# Altium schematic sheet MCU.SchDoc
size A3; SheetNumber: 3; SheetTotal: 13
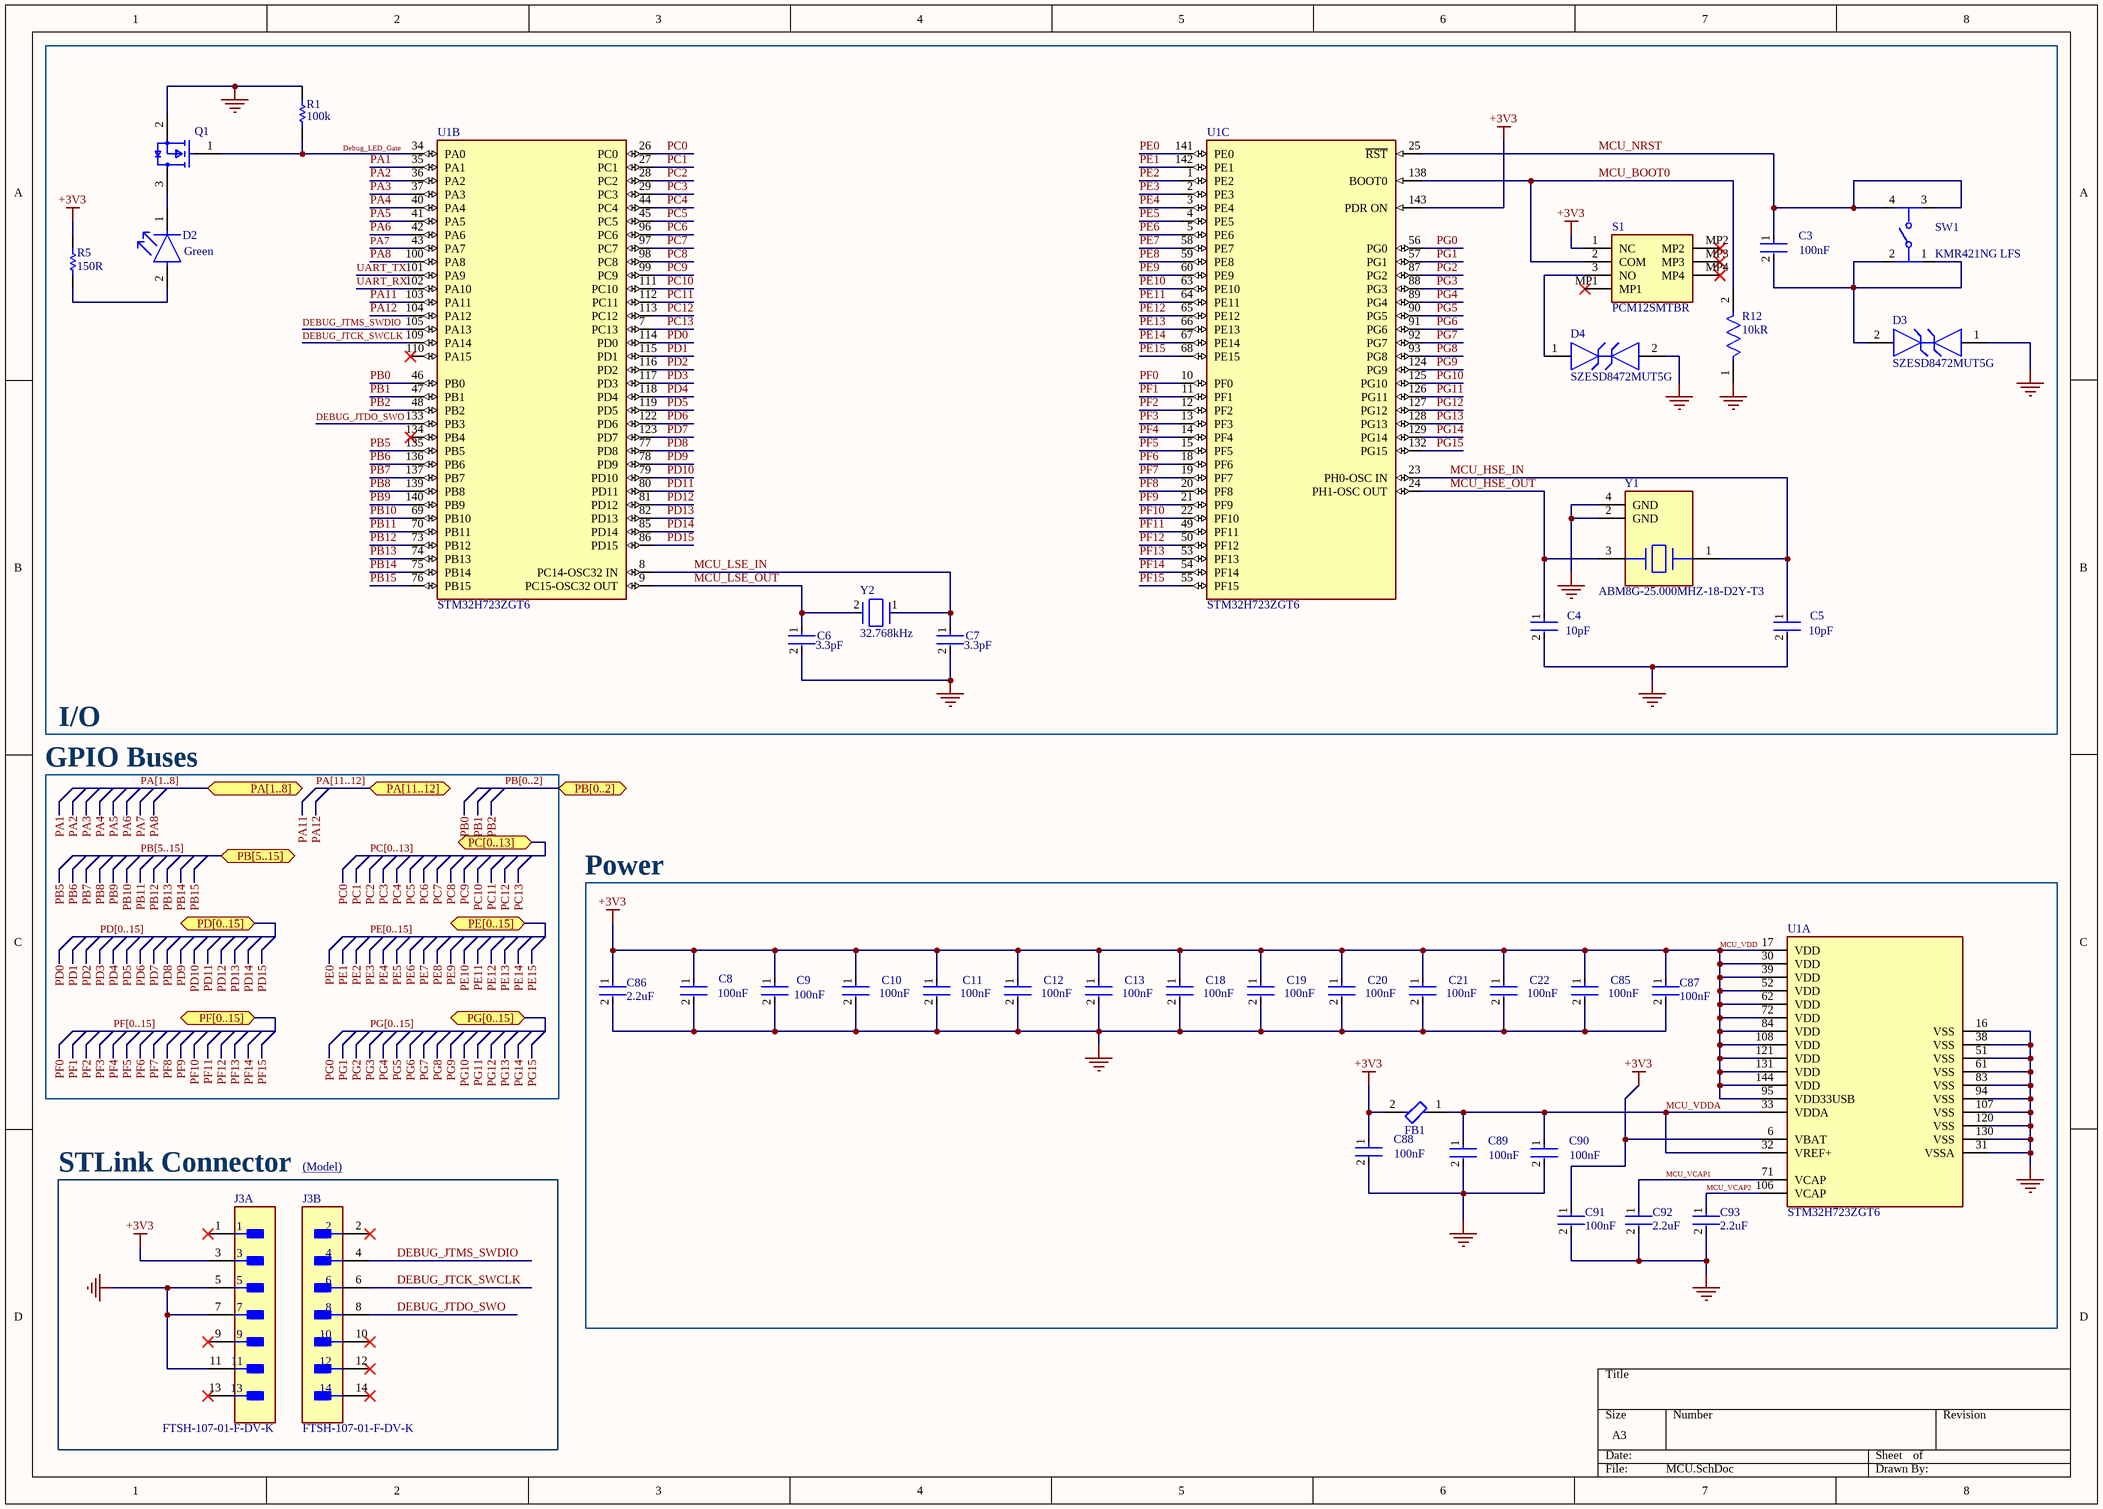
[diagram p0: MCU.SchDoc]

## Parts
C3  Capacitance: 100nF  [FP-GCM155-0_05-IPC_A]  (hidden comment: GCM155R71H104ME02J)
C4  Capacitance: 10pF  [FP-GCM155-0_05-IPC_B]  (hidden comment: GCM1555G1H100GA16D)
C5  Capacitance: 10pF  [FP-GCM155-0_05-IPC_B]  (hidden comment: GCM1555G1H100GA16D)
C6  Capacitance: 3.3pF  [FP-GCM155-0_05-IPC_C]  (hidden comment: GCM1555C1H3R3CA16J)
C7  Capacitance: 3.3pF  [FP-GCM155-0_05-IPC_C]  (hidden comment: GCM1555C1H3R3CA16J)
C8  Capacitance: 100nF  [FP-GCM155-0_05-IPC_A]  (hidden comment: GCM155R71H104ME02J)
C9  Capacitance: 100nF  [FP-GCM155-0_05-IPC_A]  (hidden comment: GCM155R71H104ME02J)
C10  Capacitance: 100nF  [FP-GCM155-0_05-IPC_A]  (hidden comment: GCM155R71H104ME02J)
C11  Capacitance: 100nF  [FP-GCM155-0_05-IPC_A]  (hidden comment: GCM155R71H104ME02J)
C12  Capacitance: 100nF  [FP-GCM155-0_05-IPC_A]  (hidden comment: GCM155R71H104ME02J)
C13  Capacitance: 100nF  [FP-GCM155-0_05-IPC_A]  (hidden comment: GCM155R71H104ME02J)
C18  Capacitance: 100nF  [FP-GCM155-0_05-IPC_A]  (hidden comment: GCM155R71H104ME02J)
C19  Capacitance: 100nF  [FP-GCM155-0_05-IPC_A]  (hidden comment: GCM155R71H104ME02J)
C20  Capacitance: 100nF  [FP-GCM155-0_05-IPC_A]  (hidden comment: GCM155R71H104ME02J)
C21  Capacitance: 100nF  [FP-GCM155-0_05-IPC_A]  (hidden comment: GCM155R71H104ME02J)
C22  Capacitance: 100nF  [FP-GCM155-0_05-IPC_A]  (hidden comment: GCM155R71H104ME02J)
C85  Capacitance: 100nF  [FP-GCM155-0_05-IPC_A]  (hidden comment: GCM155R71H104ME02J)
C86  Capacitance: 2.2uF  [FP-GCH188-0_1-e0_2_0_5-MFG]  (hidden comment: GCM188C71A225KE02D)
C87  Capacitance: 100nF  [FP-GCM155-0_05-IPC_A]  (hidden comment: GCM155R71H104ME02J)
C88  Capacitance: 100nF  [FP-GCM155-0_05-IPC_A]  (hidden comment: GCM155R71H104ME02J)
C89  Capacitance: 100nF  [FP-GCM155-0_05-IPC_A]  (hidden comment: GCM155R71H104ME02J)
C90  Capacitance: 100nF  [FP-GCM155-0_05-IPC_A]  (hidden comment: GCM155R71H104ME02J)
C91  Capacitance: 100nF  [FP-GCM155-0_05-IPC_A]  (hidden comment: GCM155R71H104ME02J)
C92  Capacitance: 2.2uF  [FP-GCH188-0_1-e0_2_0_5-MFG]  (hidden comment: GCM188C71A225KE02D)
C93  Capacitance: 2.2uF  [FP-GCH188-0_1-e0_2_0_5-MFG]  (hidden comment: GCM188C71A225KE02D)
D2  Colour: Green  [FP-SML-P1-MFG]  (hidden comment: SML-P13PTT86R)
D3  SZESD8472MUT5G  [FP-152AF-MFG]
D4  SZESD8472MUT5G  [FP-152AF-MFG]
FB1  BLM15BX102SZ1D  [FP-BLM15-0_05-MFG]  (value not drawn)
J3  FTSH-107-01-F-DV-K  [FP-FTSH-107-01-F-DV-K-MFG]  (parts A,B of 2)
Q1  2N7002H6327XTSA2  [FP-PG-SOT23-3-MFG]  (value not drawn)
R1  Resistance: 100k  [RESC1005X40X25NL05T10]  (hidden comment: RC0402FR-07100KL)
R5  Resistance: 150R  [RESC1005X40X25LL05T10]  (hidden comment: RC0402JR-13150RL)
R12  Resistance: 10kR  [FP-RC0402-0_4-IPC_A]  (hidden comment: RC0402FR-1310KL)
S1  PCM12SMTBR  [PCM12SMTBR]
SW1  KMR421NG LFS  [FP-KMR421NG_LFS-MFG]
U1  STM32H723ZGT6  [FP-LQFP144-1A-IPC_A]  (parts A,B,C of 3)
Y1  ABM8G-25.000MHZ-18-D2Y-T3  [FP-ABM8G-MFG]
Y2  Frequency: 32.768kHz  [FP-ECX-34Q-MFG]  (hidden comment: ECS-.327-6-34QCN-TR)

## Blocks framed on the sheet
I/O: C3-C7 D2-D4 Q1 R1 R5 R12 S1 SW1 U1 Y1 Y2
Power: C8-C13 C18-C22 C85-C93 FB1 U1
STLink Connector: J3

## Ports
PA[1..8] (bidir, see MCU_Connections[7A]), PA[11..12] (bidir, see MCU_Connections[7A]), PB[0..2] (bidir, see MCU_Connections[7A]), PB[5..15] (bidir, see MCU_Connections[7A]), PC[0..13] (bidir, see MCU_Connections[7A]), PD[0..15] (bidir, see MCU_Connections[7A]), PE[0..15] (bidir, see MCU_Connections[7A]), PF[0..15] (bidir, see MCU_Connections[7A]), PG[0..15] (bidir, see MCU_Connections[7A])

## Nets
GND: C4.2 C5.2 C6.2 C7.2 C8.2 C9.2 C10.2 C11.2 C12.2 C13.2 C18.2 C19.2 C20.2 C21.2 C22.2 C85.2 C86.2 C87.2 C88.2 C89.2 C90.2 C91.2 C92.2 C93.2 D3.1 D4.2 J3.5 J3.7 J3.11 Q1.2(source) R1.2 R12.1 U1.16(VSS) U1.31(VSSA) U1.38(VSS) U1.51(VSS) U1.61(VSS) U1.83(VSS) U1.94(VSS) U1.107(VSS) U1.120(VSS) U1.130(VSS) Y1.2(GND) Y1.4(GND)
MCU_VDD: C8.1 C9.1 C10.1 C11.1 C12.1 C13.1 C18.1 C19.1 C20.1 C21.1 C22.1 C85.1 C86.1 C87.1 C88.1 C91.1 FB1.2 J3.3 R5.2 S1.1(NC) U1.6(VBAT) U1.17(VDD) U1.30(VDD) U1.39(VDD) U1.52(VDD) U1.62(VDD) U1.72(VDD) U1.84(VDD) U1.95(VDD33USB) U1.108(VDD) U1.121(VDD) U1.131(VDD) U1.143(PDR_ON) U1.144(VDD)  [also labelled +3V3]
DEBUG_JTCK_SWCLK: J3.6 U1.109(PA14)
DEBUG_JTDO_SWO: J3.8 U1.133(PB3)
DEBUG_JTMS_SWDIO: J3.4 U1.105(PA13)
Debug_LED_Gate: Q1.1(gate) R1.1 U1.34(PA0)
MCU_BOOT0: R12.2 S1.2(COM) U1.138(BOOT0)
MCU_HSE_IN: C5.1 U1.23(PH0-OSC_IN) Y1.1
MCU_HSE_OUT: C4.1 U1.24(PH1-OSC_OUT) Y1.3
MCU_LSE_IN: C7.1 U1.8(PC14-OSC32_IN) Y2.1(In/Out)
MCU_LSE_OUT: C6.1 U1.9(PC15-OSC32_OUT) Y2.2(Out/In)
MCU_NRST: C3.1 SW1.3 SW1.4 U1.25(~{RST})
MCU_VCAP1: C92.1 U1.71(VCAP)
MCU_VCAP2: C93.1 U1.106(VCAP)
MCU_VDDA: C89.1 C90.1 FB1.1 U1.32(VREF+) U1.33(VDDA)
PA1: U1.35(PA1)
PA2: U1.36(PA2)
PA3: U1.37(PA3)
PA4: U1.40(PA4)
PA5: U1.41(PA5)
PA6: U1.42(PA6)
PA7: U1.43(PA7)
PA8: U1.100(PA8)
PA11: U1.103(PA11)
PA12: U1.104(PA12)
PB0: U1.46(PB0)
PB1: U1.47(PB1)
PB2: U1.48(PB2)
PB5: U1.135(PB5)
PB6: U1.136(PB6)
PB7: U1.137(PB7)
PB8: U1.139(PB8)
PB9: U1.140(PB9)
PB10: U1.69(PB10)
PB11: U1.70(PB11)
PB12: U1.73(PB12)
PB13: U1.74(PB13)
PB14: U1.75(PB14)
PB15: U1.76(PB15)
PC0: U1.26(PC0)
PC1: U1.27(PC1)
PC2: U1.28(PC2)
PC3: U1.29(PC3)
PC4: U1.44(PC4)
PC5: U1.45(PC5)
PC6: U1.96(PC6)
PC7: U1.97(PC7)
PC8: U1.98(PC8)
PC9: U1.99(PC9)
PC10: U1.111(PC10)
PC11: U1.112(PC11)
PC12: U1.113(PC12)
PC13: U1.7(PC13)
PD0: U1.114(PD0)
PD1: U1.115(PD1)
PD2: U1.116(PD2)
PD3: U1.117(PD3)
PD4: U1.118(PD4)
PD5: U1.119(PD5)
PD6: U1.122(PD6)
PD7: U1.123(PD7)
PD8: U1.77(PD8)
PD9: U1.78(PD9)
PD10: U1.79(PD10)
PD11: U1.80(PD11)
PD12: U1.81(PD12)
PD13: U1.82(PD13)
PD14: U1.85(PD14)
PD15: U1.86(PD15)
PE0: U1.141(PE0)
PE1: U1.142(PE1)
PE2: U1.1(PE2)
PE3: U1.2(PE3)
PE4: U1.3(PE4)
PE5: U1.4(PE5)
PE6: U1.5(PE6)
PE7: U1.58(PE7)
PE8: U1.59(PE8)
PE9: U1.60(PE9)
PE10: U1.63(PE10)
PE11: U1.64(PE11)
PE12: U1.65(PE12)
PE13: U1.66(PE13)
PE14: U1.67(PE14)
PE15: U1.68(PE15)
PF0: U1.10(PF0)
PF1: U1.11(PF1)
PF2: U1.12(PF2)
PF3: U1.13(PF3)
PF4: U1.14(PF4)
PF5: U1.15(PF5)
PF6: U1.18(PF6)
PF7: U1.19(PF7)
PF8: U1.20(PF8)
PF9: U1.21(PF9)
PF10: U1.22(PF10)
PF11: U1.49(PF11)
PF12: U1.50(PF12)
PF13: U1.53(PF13)
PF14: U1.54(PF14)
PF15: U1.55(PF15)
PG0: U1.56(PG0)
PG1: U1.57(PG1)
PG2: U1.87(PG2)
PG3: U1.88(PG3)
PG4: U1.89(PG4)
PG5: U1.90(PG5)
PG6: U1.91(PG6)
PG7: U1.92(PG7)
PG8: U1.93(PG8)
PG9: U1.124(PG9)
PG10: U1.125(PG10)
PG11: U1.126(PG11)
PG12: U1.127(PG12)
PG13: U1.128(PG13)
PG14: U1.129(PG14)
PG15: U1.132(PG15)
UART_RX: U1.102(PA10)
UART_TX: U1.101(PA9)
NetC3_2: C3.2 D3.2 SW1.1 SW1.2
NetD2_1: D2.1(C) Q1.3(drain)
NetD2_2: D2.2(A) R5.1
NetD4_1: D4.1 S1.3(NO)

Not connected (* = marked no-connect by the designer): J3 1* 2* 9* 10* 12* 13* 14*; S1 MP1* MP2* MP3* MP4*; U1 110(PA15)* 134(PB4)*

## Buses and harness runs
bus PA[1..8] = port PA[1..8]
bus PA[11..12] = port PA[11..12]
bus PB[0..2] = port PB[0..2]
bus PB[5..15] = port PB[5..15]
bus PC[0..13] = port PC[0..13]
bus PD[0..15] = port PD[0..15]
bus PE[0..15] = port PE[0..15]
bus PF[0..15] = port PF[0..15]
bus PG[0..15] = port PG[0..15]

## Notes on the sheet
- GPIO Buses
- (Model) <https://au.mouser.com/ProductDetail/STMicroelectronics/STLINK-V3MINIE?qs=MyNHzdoqoQKcLQe5Jawcgw%3D%3D>

## Library data of the parts
C3 C8-C13 C18-C22 C85 C87-C91 = CMP-06035-028957-1: Ceramic Capacitor for Automotive 100nF ±20% 50VDC X7R 0402 Paper T/R
C4 C5 = CMP-06035-053638-1: Ceramic Capacitor for Automotive 10pF ±2% 50VDC X8G 0402 Paper T/R
C6 C7 = CMP-06035-005325-1: Ceramic Capacitor for Automotive 3.3pF ±0.25pF 50VDC C0G 0402 Paper T/R; Voltage Rating (DC): 50V; Packaging: Tape and Reel; Max Operating Temperature: 125°C; Length: 0.039inch; Min Operating Temperature: -55°C; Ratings: AEC-Q200; Voltage Rating: 50V; Case Code (Metric): 1005; Width: 0.5mm; Case/Package: 0402; Height: 0.5mm; Weight: 0.000212oz; Mount: Surface Mount; Termination: SMD/SMT; Thickness: 0.022inch; Package Quantity: 50000; Dielectric: C0G; Case Code (Imperial): 0402
C86 C92 C93 = CMP-00260-57357036-1: GCM188C71A225KE02D Multilayer Ceramic Capacitor, 2.2 uF, 10 V, ± 10%, X7S, 0603 [1608 Metric]; NexarPartId: 57357036; RoHS: Non-Compliant; Lifecycle Status: Production
D2 = CMP-08952-000015-1: LED GREEN CLEAR 1006 SMD; Manufacturer: Rohm; Power Dissipation: 52mW; Forward Current: 20mA; Reverse Voltage: 5V; Led Orientation: Top View; Forward Voltage: 2.1V; Luminous Intensity: 10mcd; Wavelength: 560nm; Temperature: -40°C to +85°C; Digikey Description: LED GREEN CLEAR 1006 SMD; Manufacturer Part Number: SML-P13PTT86R; Lead Free: Yes; Height: 0.25mm; Package: SML-P1; RoHS: TRUE; Mouser Description: LED Uni-Color Green 2-Pin Chip 0402(1006Metric) T/R; Device Class L2: LEDs; ComponentLink2URL: https://d1d2qsbl8m0m72.cloudfront.net/en/products/databook/datasheet/opto/led/chip_mono/sml-p1-e.pdf; Device Class L1: Optoelectronics; ComponentLink2Description: Datasheet; Category: Diode; Temperature Range High: +85°C; Automotive: No; Temperature Range Low: -40°C; Octopart: https://octopart.com/sml-p13ptt86r-rohm-59370256; Device Class L3: unset
D3 D4 = CMP-07200-000010-1: TVS DIODE 5.3V 14V 2X3DFN; Number of Bidirectional Channels: 1; Element Configuration: Single; Capacitance: 0.3pF; Peak Pulse Current: 3A; Power Line Protection: No; Min Breakdown Voltage: 7V; Direction: Bidirectional; Case/Package: DFN; Lead Free: Lead Free; Reverse Standoff Voltage: 5.3V; Clamping Voltage: 14V; Resistor Type: Zener; Packaging: Tape and Reel; Mount: Surface Mount; Number of Pins: 2; Max Operating Temperature: 150°C; Min Operating Temperature: -55°C; Working Voltage: 5.3V; RoHS Compliant: Yes
FB1 = CMP-06046-001231-1: Chip Ferrite Bead, 0402, 1000Ω @ 100MHz, 0.65Ω, 25%, 300mA
J3 = CMP-02766-001448-1: CONN HEADER SMD 14POS 1.27MM; Gender: Male; Connector Type: Male Pin; Number of Contacts: 14; Row Spacing: 0.05inch; Min Operating Temperature: -55°C; Package Quantity: 1; Lead Free: Lead Free; RoHS Compliant: Yes; Contact Material: Bronze; Contact Plating: Gold; Number of Rows: 2; Housing Material: Polymer; Contact Type: Male Pin; Series: FTSH; Max Operating Temperature: 125°C; Orientation: Straight; Number of Positions: 14; Pitch: 1.27mm; Housing Color: Black; Color: Black; Radiation Hardening: No; Length: 8.89mm; Termination: Solder; Packaging: Rail/Tube; Depth: 5.84mm; Mount: Surface Mount; Contact Mating Length: 0.12inch
Q1 = CMP-32901-000180-1: MOSFET N-CH 60V 0.3A SOT23; Rise Time: 3.3ns; Input Capacitance: 20pF; Rds On Max: 3R; Gate to Source Voltage (Vgs): 20V; Continuous Drain Current (ID): 300mA; Max Power Dissipation: 500mW; Packaging: Tape and Reel; Mount: Surface Mount; Case/Package: SOT-23; Drain to Source Voltage (Vdss): 60V; Min Operating Temperature: -55°C; Halogen Free: Halogen Free; Max Dual Supply Voltage: 60V; Number of Pins: 3; Lead Free: Lead Free; Max Operating Temperature: 150°C
R1 = CMP-2002-07343-1: Manufacturer: Yageo / Phycomp; Part Number: RC0402FR-07100KL
R5 = CMP-2002-08067-1: Manufacturer: Yageo; Part Number: RC0402JR-13150RL
R12 = CMP-2002-07854-2: RESISTOR 0402 10K 1%; Power Rating: 62.5mW; Voltage Rating (DC): 50V; Temperature Coefficient: 100ppm/°C; REACH SVHC: No SVHC; Case/Package: 0402; Termination: SMD/SMT; Max Operating Temperature: 155°C; Contact Plating: Tin; Resistance Tolerance: 1%; Radiation Hardening: No; Voltage Rating: 50V; Lead Free: Lead Free; Length: 1mm; Depth: 0.5mm; Number of Pins: 2; RoHS Compliant: Yes; Case Code (Imperial): 0402; Case Code (Metric): 1005; Min Operating Temperature: -55°C; Packaging: Tape and Reel; Technology: THICK FILM; Series: RC; Number of Terminations: 2; Resistor Type: Thick Film; Tolerance: 1%; Working Voltage: 50V; Military Standard: Not; Construction: Rectangular
S1 = PCM12SMTBR: Switch; Manufacturer_Name: C & K COMPONENTS; Datasheet Link: https://www.ckswitches.com/media/1424/pcm.pdf; Height: 1.4mm; Manufacturer_Part_Number: PCM12SMTBR; Mouser Part Number: 611-PCM12SMTBR; Mouser Price/Stock: https://www.mouser.co.uk/ProductDetail/CK/PCM12SMTBR?qs=By6Nw2ByBD1OEOnWcdZb2g%3D%3D; Arrow Part Number: PCM12SMTBR; Arrow Price/Stock: https://www.arrow.com/en/products/pcm12smtbr/ck?utm_currency=USD&region=europe
SW1 = CMP-10040-000003-1: SWITCH TACTILE SPST-NO 0.05A 32V; Manufacturer: C&K Components; Contact Resistance: 100mΩ; Operating Force: 2N; Current Rating: 50mA; Electromechanical Life: 100000Cycles; ComponentLink2URL: https://www.ckswitches.com/media/1480/kmr4.pdf; Automotive: No; Device Class L2: Switches; Temperature Range Low: -40°C; Temperature: -40°C to +85°C; Digikey Description: SWITCH TACTILE SPST-NO 0.05A 32V; Category: Switch; ComponentLink2Description: Datasheet; Octopart: https://octopart.com/kmr421nglfs-c%26k+components-7226706; Mouser Description: Switch Tactile N.O. SPST Round Button Gull Wing 0.05A 32VDC 1VA 2N SMD Automotive T/R; Package: KMR421NG LFS; Manufacturer Part Number: KMR421NG LFS; Lead Free: Yes; Throw Configuration: SPST-NO; Height: 2.5mm; Device Class L3: Tactile Switches; Mount: Surface Mount; Device Class L1: Electromechanical; RoHS: TRUE; Temperature Range High: +85°C; Voltage Rating Dc: 32V
U1 = CMP-12105-000148-1: IC MCU 32BIT 1MB FLASH 144LQFP
Y1 = CMP-27762-015132-1: Crystal 25MHz ±20ppm (Tol) ±30ppm (Stability) 18pF FUND 60Ω 4-Pin SMD T/R; ESR (Equivalent Series Resistance): 60R; Termination: SMD/SMT; Series: ABM8G; Max Operating Temperature: 85°C; Width: 2.5mm; Radiation Hardening: No; Mount: Surface Mount; Package Quantity: 3000; Frequency Stability: 30ppm; Min Operating Temperature: -40°C; Packaging: Tape and Reel; Number of Pins: 4; Frequency: 25MHz; Height: 0.039inch; Tolerance: 20ppm; Length: 3.2mm; Frequency Tolerance: 20ppm; Series Resistance: 60R; Depth: 2.5mm; Case/Package: SMD/SMT; Load Capacitance: 18pF
Y2 = CMP-40224-000010-1: CRYSTAL 32.768KHZ 6PF SMD; Manufacturer: ECS Inc.; Esr: 70kΩ; Tolerance: 10ppm; Automotive Grade: Grade 3; ComponentLink2Description: Datasheet; Automotive: Yes; Temperature Range Low: -40°C; Manufacturer Part Number: ECS-.327-6-34QCN-TR; Device Class L2: Crystals / Oscillators; Temperature Range High: +85°C; Series: ECX-34Q; ComponentLink2URL: https://ecsxtal.com/store/pdf/ECX-34Q.pdf; Device Class L3: Crystals; Device Class L1: Passive Components; Octopart: https://octopart.com/ecs-.327-6-34qcn-tr-ecs+international-97157707; Load Capacitance: 6pF; Temperature: -40°C to +85°C; Category: Crys; Lead Free: Yes; Package: ECX-34Q; RoHS: TRUE; Digikey Description: CRYSTAL 32.768KHZ 6PF SMD; Height: 0.9mm